# Altium schematic sheet LCD_XOR.SchDoc: LCD XOR Driver
size B; Organization: Altium Limited; Address1: L3, 12a Rodborough Rd; Address2: Frenchs Forest; Address3: NSW; Address4: Australia 2086; DocumentNumber: 2; SheetNumber: 2; SheetTotal: 2
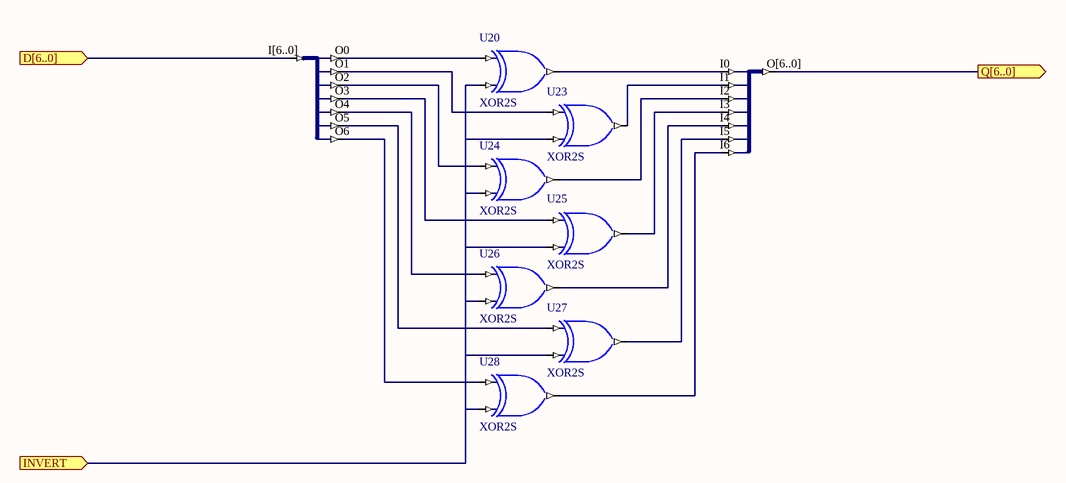
[diagram p0: LCD_XOR.SchDoc]

## Parts
U20  XOR2S
U21  J7B_7S  (value not drawn)
U22  J7S_7B  (value not drawn)
U23  XOR2S
U24  XOR2S
U25  XOR2S
U26  XOR2S
U27  XOR2S
U28  XOR2S

## Ports
D[6..0] (in), INVERT (in), Q[6..0] (out)

## Nets
D[6..0]: U21.I[6..0] ; port D[6..0]
INVERT: U20.I1 U23.I1 U24.I1 U25.I1 U26.I1 U27.I1 U28.I1 ; port INVERT
Q[6..0]: U22.O[6..0] ; port Q[6..0]
NetU20_I0: U20.I0 U21.O0
NetU20_O: U20.O U22.I0
NetU21_O1: U21.O1 U23.I0
NetU21_O2: U21.O2 U24.I0
NetU21_O3: U21.O3 U25.I0
NetU21_O4: U21.O4 U26.I0
NetU21_O5: U21.O5 U27.I0
NetU21_O6: U21.O6 U28.I0
NetU22_I1: U22.I1 U23.O
NetU22_I2: U22.I2 U24.O
NetU22_I3: U22.I3 U25.O
NetU22_I4: U22.I4 U26.O
NetU22_I5: U22.I5 U27.O
NetU22_I6: U22.I6 U28.O

## Notes on the sheet
- Title
- Size:
- Date:
- B
- Number:
- Time:
- Revision:
- Sheet
- of
- File:

## Library data of the parts
U20 U23-U28 = XOR2S: 2-Input Exclusive-OR Gate, Single Pin Version; XilinxEquivalent: XOR2; FunctionalClass: Logic Primitive; SubClass: XOR; PortSize: 2; ArchiveName: GENERIC; VHDLIB_SIM: GENERIC_LIB; Published: 29-Jan-2004; Publisher: Altium Limited; LastRevisionNo: 1.00.00; HelpURL: CR0118 FPGA Generic Library Guide.pdf#page=437; PortStyle: Single Pin Version
U21 = J7B_7S: 7-Bit input bus to 7 Single pin outputs; FunctionalClass: Bus Joiner; PortSize: 7; ArchiveName: GENERIC; VHDLIB_SIM: GENERIC_LIB; Published: 29-Jan-2004; Publisher: Altium Limited; LastRevisionNo: 1.00.00; HelpURL: CR0118 FPGA Generic Library Guide.pdf#page=303
U22 = J7S_7B: 7 Single pin inputs to single 7-Bit output bus; FunctionalClass: Bus Joiner; PortSize: 7; ArchiveName: GENERIC; VHDLIB_SIM: GENERIC_LIB; Published: 29-Jan-2004; Publisher: Altium Limited; LastRevisionNo: 1.00.00; HelpURL: CR0118 FPGA Generic Library Guide.pdf#page=305